# EAGLE schematic SSv3_1 (EAGLE 9.3.0)

## Sheet 1 of 6: PIC24FJ256GB106 POWER USB TRIGGER
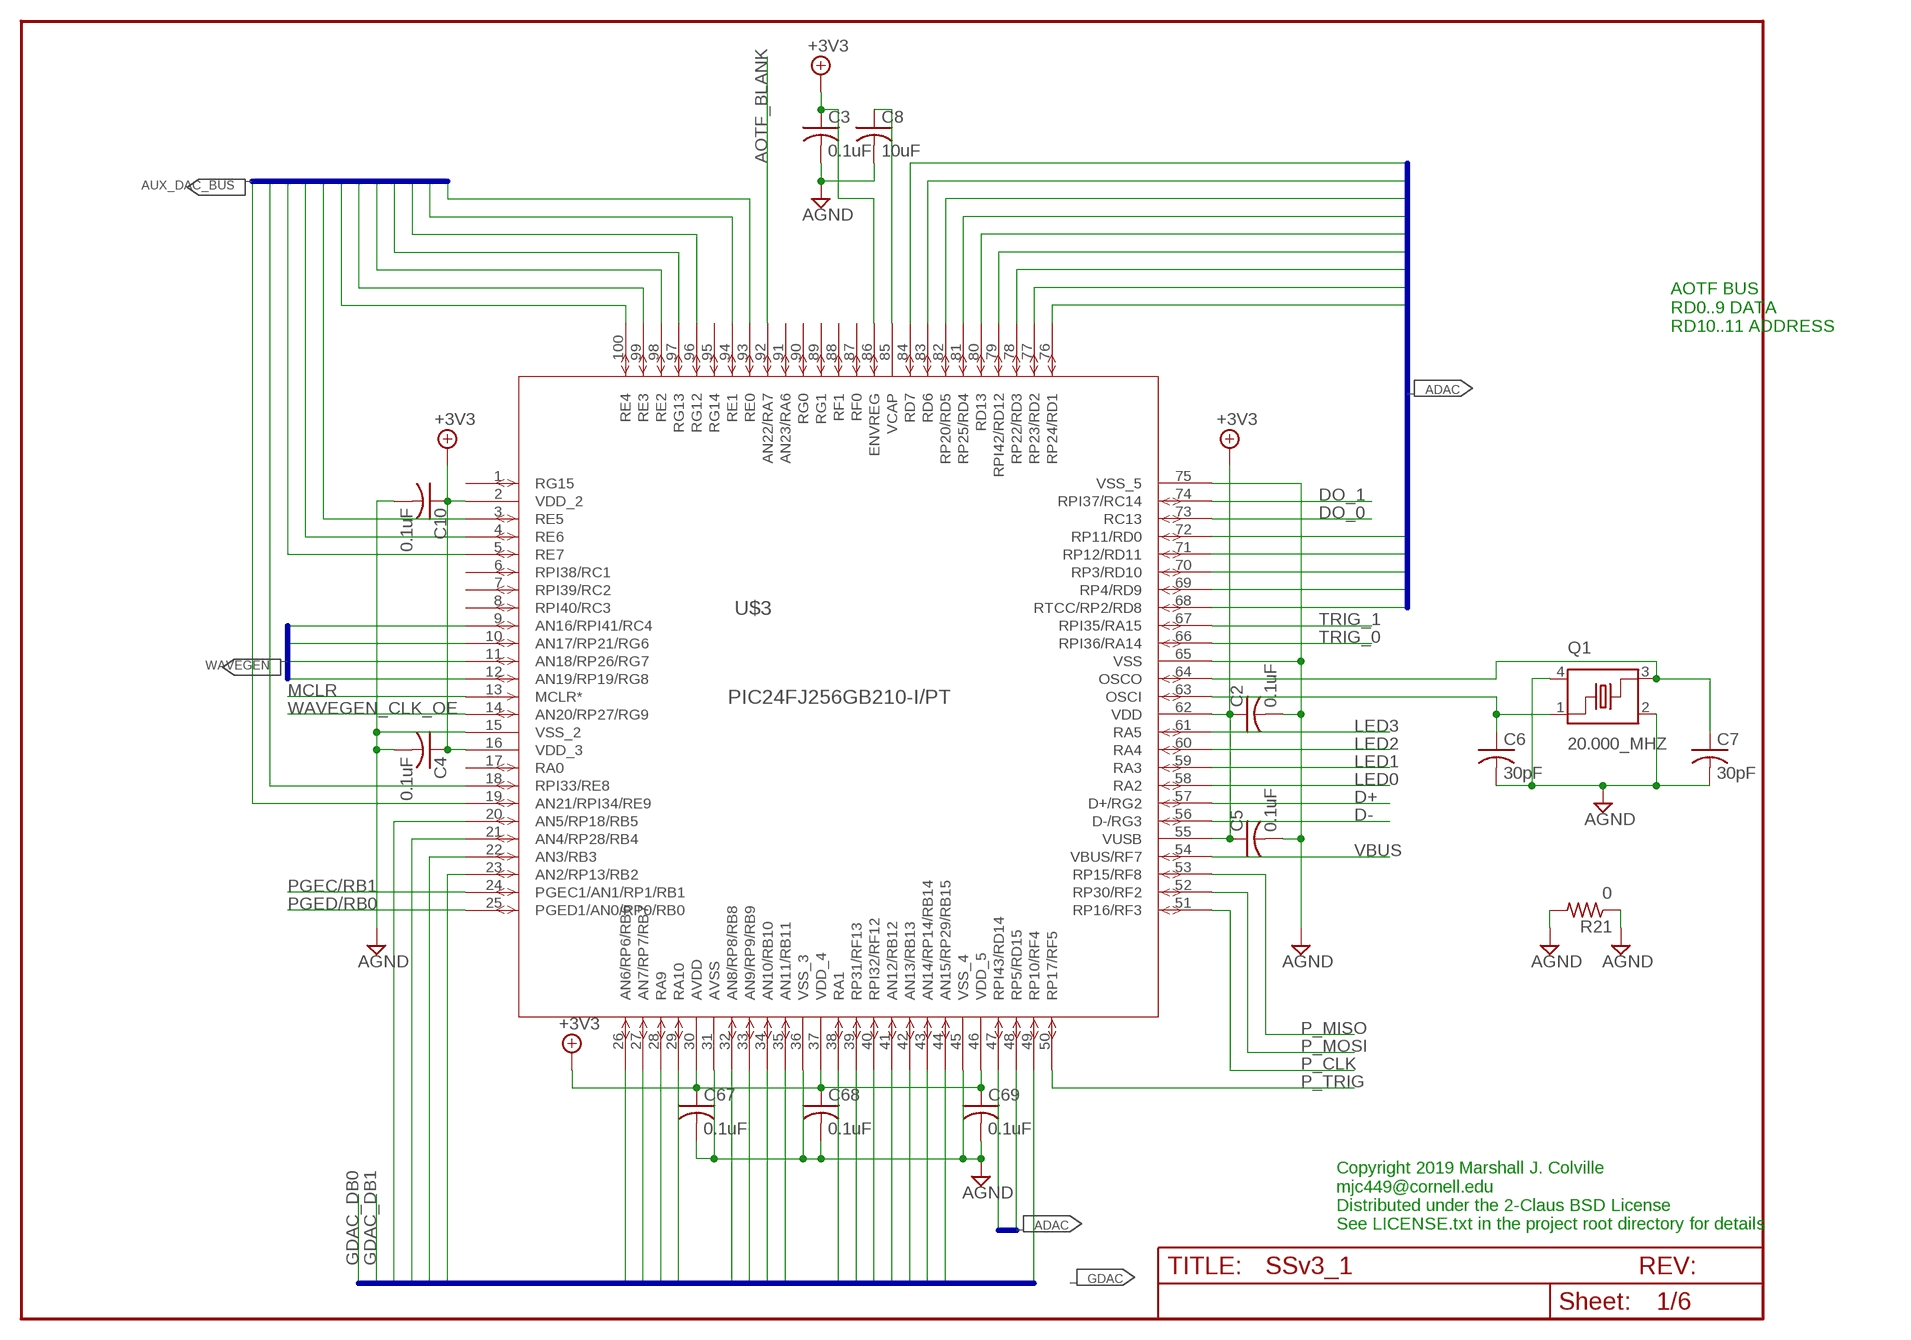
[diagram p0: schematic, sheet 1]

### Parts
C2  0.1uF  C-USC0603  [C0603]
C3  0.1uF  C-USC0603  [C0603]
C4  0.1uF  C-USC0603  [C0603]
C5  0.1uF  C-USC0603  [C0603]
C6  30pF  C-USC0603  [C0603]
C7  30pF  C-USC0603  [C0603]
C8  10uF  C-USC0805  [C0805]
C10  0.1uF  C-USC0603  [C0603]
C67  0.1uF  C-USC0603  [C0603]
C68  0.1uF  C-USC0603  [C0603]
C69  0.1uF  C-USC0603  [C0603]
Q1  20.000_MHZ  CRYSTALCTS406  [CTS406]
R21  0  R-US_R0603  [R0603]
U$3  PIC24FJ256GB210-I/PT  [TQFP100_12X12MC]

### Nets
+3V3: C2.1 C3.1 C4.1 C5.1 C10.1 C67.1 C68.1 C69.1 U$3.2(VDD_2) U$3.16(VDD_3) U$3.30(AVDD) U$3.37(VDD_4) U$3.46(VDD_5) U$3.55(VUSB) U$3.62(VDD) U$3.86(ENVREG) ; also sheet 2,3,4,5,6
ADAC0: U$3.72(RP11/RD0) ; also sheet 3
ADAC0_CS: U$3.79(RPI42/RD12) ; also sheet 3
ADAC1: U$3.76(RP24/RD1) ; also sheet 3
ADAC1_CS: U$3.80(RD13) ; also sheet 3
ADAC2: U$3.77(RP23/RD2) ; also sheet 3
ADAC3: U$3.78(RP22/RD3) ; also sheet 3
ADAC4: U$3.81(RP25/RD4) ; also sheet 3
ADAC5: U$3.82(RP20/RD5) ; also sheet 3
ADAC6: U$3.83(RD6) ; also sheet 3
ADAC7: U$3.84(RD7) ; also sheet 3
ADAC8: U$3.68(RTCC/RP2/RD8) ; also sheet 3
ADAC9: U$3.69(RP4/RD9) ; also sheet 3
ADAC_A0: U$3.70(RP3/RD10) ; also sheet 3
ADAC_A1: U$3.71(RP12/RD11) ; also sheet 3
ADAC_LOAD: U$3.47(RPI43/RD14) ; also sheet 3
ADAC_RS: U$3.48(RP5/RD15) ; also sheet 3
AGND: C2.2 C3.2 C4.2 C5.2 C6.2 C7.2 C8.2 C10.2 C67.2 C68.2 C69.2 Q1.2 Q1.4 R21.1 R21.2 U$3.15(VSS_2) U$3.31(AVSS) U$3.36(VSS_3) U$3.45(VSS_4) U$3.65(VSS) U$3.75(VSS_5) ; also sheet 2,3,4,5,6
AOTF_BLANK: U$3.92(AN22/RA7) ; also sheet 3
AUX_DAC_A/B: U$3.97(RG13) ; also sheet 4
AUX_DAC_CS: U$3.96(RG12) ; also sheet 4
AUX_DAC_DB0: U$3.93(RE0) ; also sheet 4
AUX_DAC_DB1: U$3.94(RE1) ; also sheet 4
AUX_DAC_DB2: U$3.98(RE2) ; also sheet 4
AUX_DAC_DB3: U$3.99(RE3) ; also sheet 4
AUX_DAC_DB4: U$3.100(RE4) ; also sheet 4
AUX_DAC_DB5: U$3.3(RE5) ; also sheet 4
AUX_DAC_DB6: U$3.4(RE6) ; also sheet 4
AUX_DAC_DB7: U$3.5(RE7) ; also sheet 4
AUX_DAC_DB8: U$3.18(RPI33/RE8) ; also sheet 4
AUX_DAC_DB9: U$3.19(AN21/RPI34/RE9) ; also sheet 4
D+: U$3.57(D+/RG2) ; also sheet 2
D-: U$3.56(D-/RG3) ; also sheet 2
DO_0: U$3.73(RC13) ; also sheet 2
DO_1: U$3.74(RPI37/RC14) ; also sheet 2
GDAC_A0: U$3.28(RA9) ; also sheet 6
GDAC_A1: U$3.29(RA10) ; also sheet 6
GDAC_DB2: U$3.23(AN2/RP13/RB2) ; also sheet 6
GDAC_DB3: U$3.22(AN3/RB3) ; also sheet 6
GDAC_DB4: U$3.21(AN4/RP28/RB4) ; also sheet 6
GDAC_DB5: U$3.20(AN5/RP18/RB5) ; also sheet 6
GDAC_DB6: U$3.26(AN6/RP6/RB6) ; also sheet 6
GDAC_DB7: U$3.27(AN7/RP7/RB7) ; also sheet 6
GDAC_DB8: U$3.32(AN8/RP8/RB8) ; also sheet 6
GDAC_DB9: U$3.33(AN9/RP9/RB9) ; also sheet 6
GDAC_DB10: U$3.34(AN10/RB10) ; also sheet 6
GDAC_DB11: U$3.35(AN11/RB11) ; also sheet 6
GDAC_DB12: U$3.41(AN12/RB12) ; also sheet 6
GDAC_DB13: U$3.42(AN13/RB13) ; also sheet 6
GDAC_DB14: U$3.43(AN14/RP14/RB14) ; also sheet 6
GDAC_DB15: U$3.44(AN15/RP29/RB15) ; also sheet 6
GDAC_LOAD: U$3.40(RPI32/RF12) ; also sheet 6
GDAC_RS: U$3.38(RA1) ; also sheet 6
LED0: U$3.58(RA2) ; also sheet 2
LED1: U$3.59(RA3) ; also sheet 2
LED2: U$3.60(RA4) ; also sheet 2
LED3: U$3.61(RA5) ; also sheet 2
MCLR: U$3.13(MCLR*) ; also sheet 2
N$1: C8.1 U$3.85(VCAP)
N$11: C6.1 Q1.1 U$3.63(OSCI)
N$34: C7.1 Q1.3 U$3.64(OSCO)
P_CLK: U$3.51(RP16/RF3) ; also sheet 2
P_MISO: U$3.53(RP15/RF8) ; also sheet 2
P_MOSI: U$3.52(RP30/RF2) ; also sheet 2
P_TRIG: U$3.50(RP17/RF5) ; also sheet 2
PGEC/RB1: U$3.24(PGEC1/AN1/RP1/RB1) ; also sheet 2
PGED/RB0: U$3.25(PGED1/AN0/RP0/RB0) ; also sheet 2
TRIG_0: U$3.66(RPI36/RA14) ; also sheet 2
TRIG_1: U$3.67(RPI35/RA15) ; also sheet 2
VBUS: U$3.54(VBUS/RF7) ; also sheet 2
WAVEGEN_CLK_OE: U$3.14(AN20/RP27/RG9) ; also sheet 5
WAVEGEN_SCK: U$3.10(AN17/RP21/RG6) ; also sheet 5
WAVEGEN_SYNC: U$3.11(AN18/RP26/RG7) ; also sheet 5
X_WAVEGEN_SDI: U$3.9(AN16/RPI41/RC4) ; also sheet 5
X_WR: U$3.39(RP31/RF13) ; also sheet 6
Y_WAVEGEN_SDI: U$3.12(AN19/RP19/RG8) ; also sheet 5
Y_WR: U$3.49(RP10/RF4) ; also sheet 6
Unconnected: U$3.1(RG15) U$3.6(RPI38/RC1) U$3.7(RPI39/RC2) U$3.8(RPI40/RC3) U$3.17(RA0) U$3.87(RF0) U$3.88(RF1) U$3.89(RG1) U$3.90(RG0) U$3.91(AN23/RA6) U$3.95(RG14)

### Buses
ADAC[0..9],ADAC_A0,ADAC_A1,ADAC0_CS,ADAC1_CS,ADAC_LOAD,ADAC_RS
AUX_DAC_DB[0..9],AUX_DAC_CS,AUX_DAC_A/B
WAVEGEN_SCK,WAVEGEN_SYNC,X_WAVEGEN_SDI,Y_WAVEGEN_SDI
GDAC_RS,X_WR,Y_WR,GDAC_LOAD,GDAC_A0,GDAC_A1,GDAC_DB[0..15]

### Notes on the sheet
- AOTF BUS
  RD0..9 DATA
  RD10..11 ADDRESS
- Copyright 2019 Marshall J. Colville
  mjc449@cornell.edu
  Distributed under the 2-Claus BSD License
  See LICENSE.txt in the project root directory for details

## Sheet 2 of 6: DIO, POWER, MISC
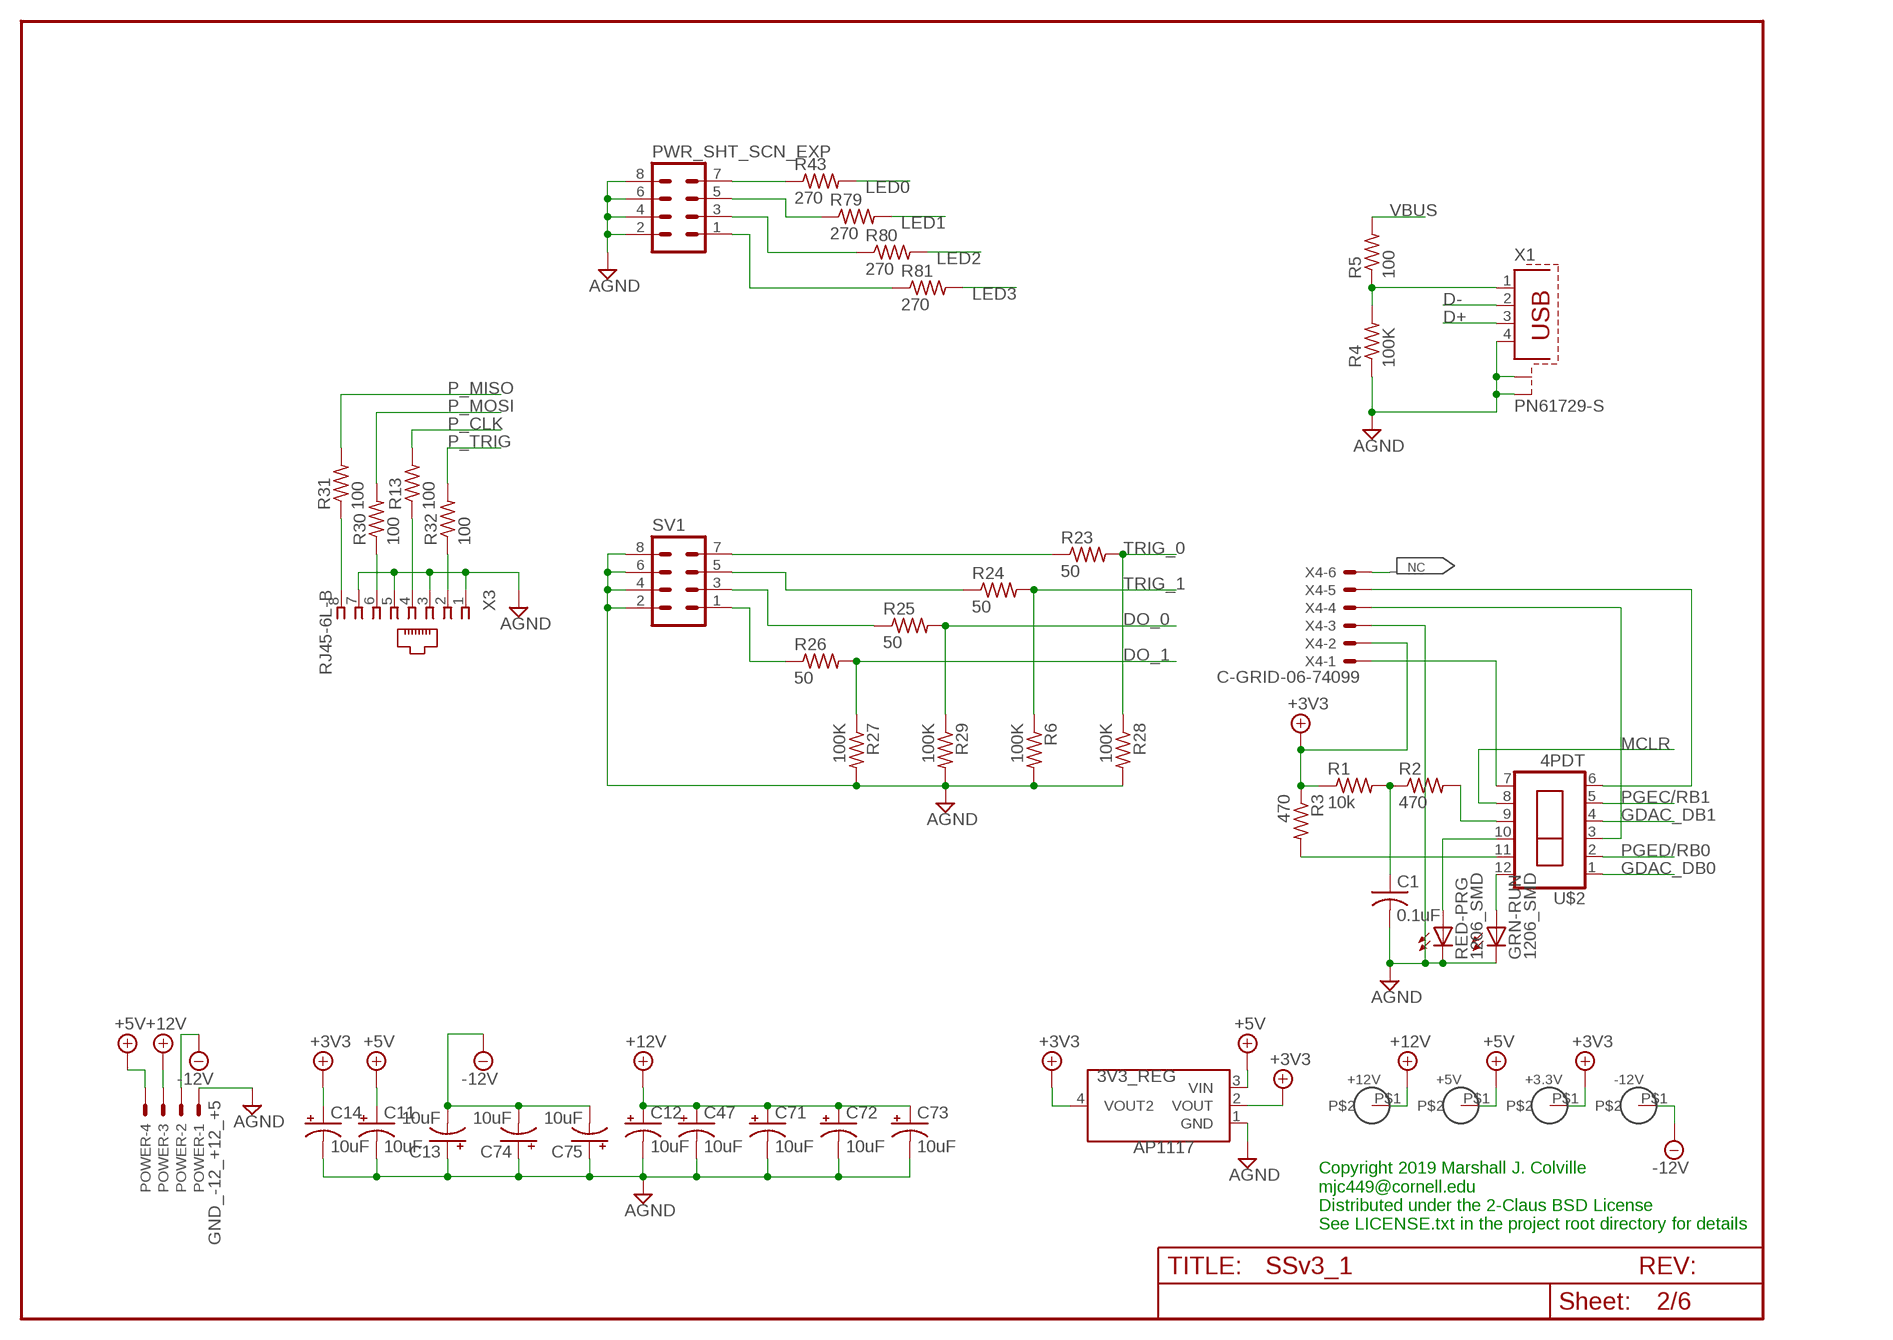
[diagram p1: schematic, sheet 2]

### Parts
3V3_REG  AP1117  AP1117E33G_REG  [SOT223]
+3.3V  TESTPOINT  [TESTPOINT]
+5V  TESTPOINT  [TESTPOINT]
+12V  TESTPOINT  [TESTPOINT]
-12V  TESTPOINT  [TESTPOINT]
C1  0.1uF  C-USC0603  [C0603]
C11  10uF  CPOL-USB  [PANASONIC_B]
C12  10uF  CPOL-USB  [PANASONIC_B]
C13  10uF  CPOL-USB  [PANASONIC_B]
C14  10uF  CPOL-USB  [PANASONIC_B]
C47  10uF  CPOL-USB  [PANASONIC_B]
C71  10uF  CPOL-USB  [PANASONIC_B]
C72  10uF  CPOL-USB  [PANASONIC_B]
C73  10uF  CPOL-USB  [PANASONIC_B]
C74  10uF  CPOL-USB  [PANASONIC_B]
C75  10uF  CPOL-USB  [PANASONIC_B]
GRN-RUN  1206_SMD  LED_1206_GREEN1206  [LED-1206]
POWER  GND_-12_+12_+5  4PINPIGTAIL  [22-23-2041]
PWR_SHT_SCN_EXP  MA04-2  [MA04-2]
R1  10k  R-US_R0603  [R0603]
R2  470  R-US_R0603  [R0603]
R3  470  R-US_R0603  [R0603]
R4  100K  R-US_R0603  [R0603]
R5  100  R-US_R0603  [R0603]
R6  100K  R-US_R0603  [R0603]
R13  100  R-US_R0603  [R0603]
R23  50  R-US_R0603  [R0603]
R24  50  R-US_R0603  [R0603]
R25  50  R-US_R0603  [R0603]
R26  50  R-US_R0603  [R0603]
R27  100K  R-US_R0603  [R0603]
R28  100K  R-US_R0603  [R0603]
R29  100K  R-US_R0603  [R0603]
R30  100  R-US_R0603  [R0603]
R31  100  R-US_R0603  [R0603]
R32  100  R-US_R0603  [R0603]
R43  270  R-US_R0603  [R0603]
R79  270  R-US_R0603  [R0603]
R80  270  R-US_R0603  [R0603]
R81  270  R-US_R0603  [R0603]
RED-PRG  1206_SMD  LED_1206_RED1206  [LED-1206]
SV1  MA04-2  [MA04-2]
U$2  4PDT  4PDTSMD_GULL_WING  [4PDT_SMD]
X1  PN61729-S  [PN61729-S]
X3  RJ45-6L-B  [RJ45-NO-SHIELD]
X4  C-GRID-06-74099  [74099-06]

### Nets
+3V3: 3V3_REG.2(VOUT) 3V3_REG.4(VOUT2) +3.3V.P$1 C14.+ R1.1 R3.1 X4.2 ; also sheet 1,3,4,5,6
+5V: 3V3_REG.3(VIN) +5V.P$1 C11.+ POWER.4 ; also sheet 3
+12V: +12V.P$1 C12.+ C47.+ C71.+ C72.+ C73.+ POWER.3 ; also sheet 3,4,5,6
-12V: -12V.P$1 C13.- C74.- C75.- POWER.2 ; also sheet 4,5,6
AGND: 3V3_REG.1(GND) C1.2 C11.- C12.- C13.+ C14.- C47.- C71.- C72.- C73.- C74.+ C75.+ GRN-RUN.C POWER.1 PWR_SHT_SCN_EXP.2 PWR_SHT_SCN_EXP.4 PWR_SHT_SCN_EXP.6 PWR_SHT_SCN_EXP.8 R4.1 R6.2 R27.2 R28.2 R29.2 RED-PRG.C SV1.2 SV1.4 SV1.6 SV1.8 X1.4 X1.S1 X1.S2 X3.1 X3.3 X3.5 X3.7 X4.3 ; also sheet 1,3,4,5,6
D+: X1.3 ; also sheet 1
D-: X1.2 ; also sheet 1
DO_0: R25.2 R29.1 ; also sheet 1
DO_1: R26.2 R27.1 ; also sheet 1
GDAC_DB0: U$2.1 ; also sheet 1,6
GDAC_DB1: U$2.4 ; also sheet 1,6
LED0: R43.2 ; also sheet 1
LED1: R79.2 ; also sheet 1
LED2: R80.2 ; also sheet 1
LED3: R81.2 ; also sheet 1
MCLR: U$2.8 ; also sheet 1
N$2: U$2.7 X4.1
N$3: PWR_SHT_SCN_EXP.7 R43.1
N$4: R2.2 U$2.9
N$5: C1.1 R1.2 R2.1
N$6: R3.2 U$2.11
N$7: RED-PRG.A U$2.10
N$8: GRN-RUN.A U$2.12
N$12: R31.1 X3.8
N$32: R30.1 X3.6
N$39: PWR_SHT_SCN_EXP.5 R79.1
N$44: PWR_SHT_SCN_EXP.3 R80.1
N$45: PWR_SHT_SCN_EXP.1 R81.1
N$47: R13.1 X3.4
N$48: R32.1 X3.2
N$50: X4.6
N$64: R25.1 SV1.3
N$87: R24.1 SV1.5
N$88: R23.1 SV1.7
N$89: R26.1 SV1.1
P_CLK: R13.2 ; also sheet 1
P_MISO: R31.2 ; also sheet 1
P_MOSI: R30.2 ; also sheet 1
P_TRIG: R32.2 ; also sheet 1
PGEC: U$2.6 X4.5
PGEC/RB1: U$2.5 ; also sheet 1
PGED: U$2.3 X4.4
PGED/RB0: U$2.2 ; also sheet 1
TRIG_0: R23.2 R28.1 ; also sheet 1
TRIG_1: R6.1 R24.2 ; also sheet 1
USB1: R4.2 R5.1 X1.1
VBUS: R5.2 ; also sheet 1

### Notes on the sheet
- Copyright 2019 Marshall J. Colville
  mjc449@cornell.edu
  Distributed under the 2-Claus BSD License
  See LICENSE.txt in the project root directory for details

## Sheet 3 of 6: AOTF DAC
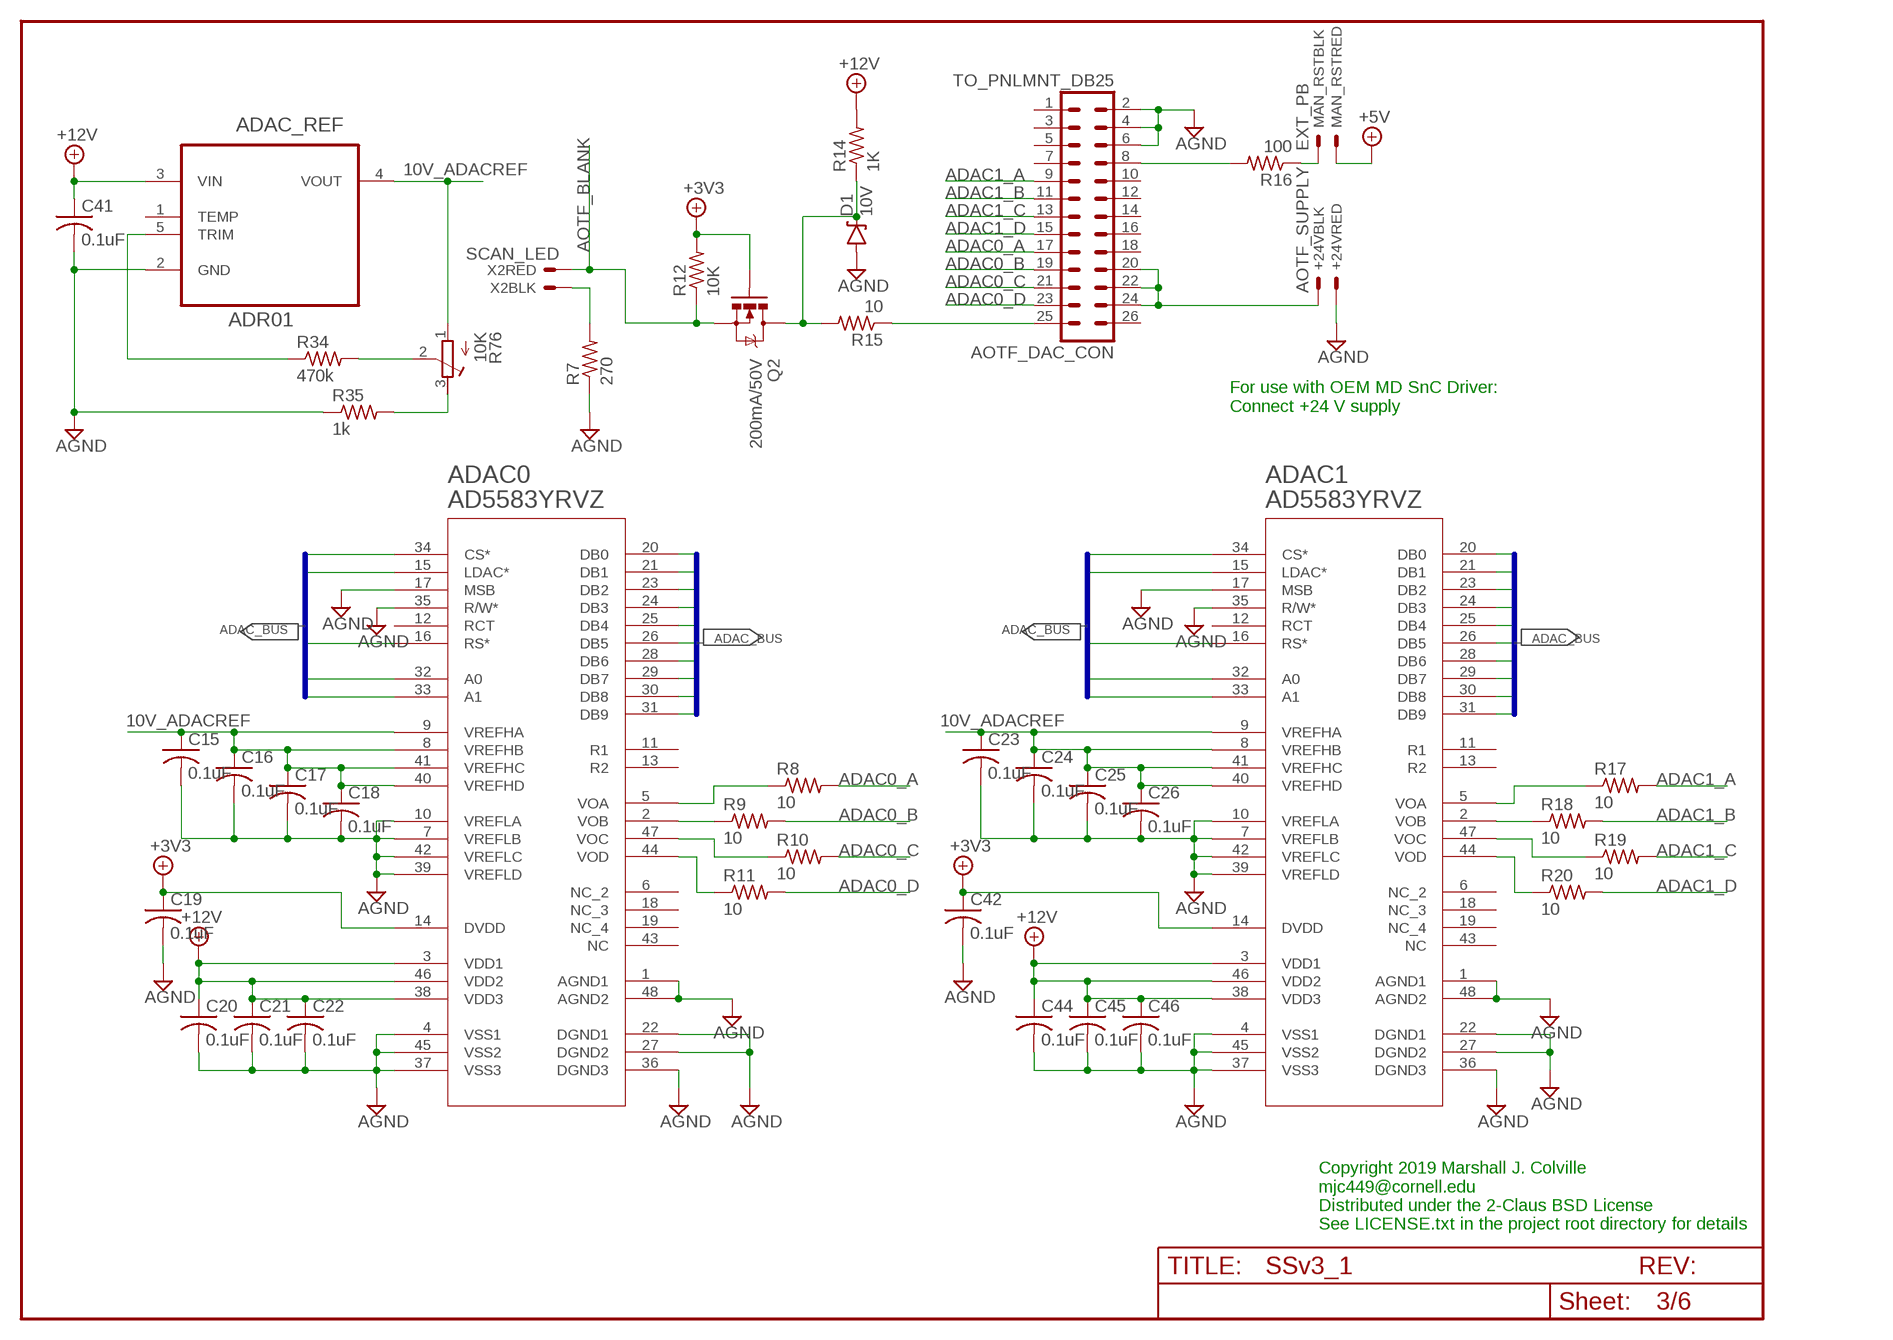
[diagram p2: schematic, sheet 3]

### Parts
+24V  AOTF_SUPPLY  2PINHEADER  [22-23-2021]
ADAC0  AD5583YRVZ  [RV_48]
ADAC1  AD5583YRVZ  [RV_48]
ADAC_REF  ADR01  ADR03AKSZ-REEL7  [SOT65P210X110-5N]
AOTF_DAC_CON  TO_PNLMNT_DB25  ML26  [ML26]
C15  0.1uF  C-USC0603  [C0603]
C16  0.1uF  C-USC0603  [C0603]
C17  0.1uF  C-USC0603  [C0603]
C18  0.1uF  C-USC0603  [C0603]
C19  0.1uF  C-USC0603  [C0603]
C20  0.1uF  C-USC0603  [C0603]
C21  0.1uF  C-USC0603  [C0603]
C22  0.1uF  C-USC0603  [C0603]
C23  0.1uF  C-USC0603  [C0603]
C24  0.1uF  C-USC0603  [C0603]
C25  0.1uF  C-USC0603  [C0603]
C26  0.1uF  C-USC0603  [C0603]
C41  0.1uF  C-USC0603  [C0603]
C42  0.1uF  C-USC0603  [C0603]
C44  0.1uF  C-USC0603  [C0603]
C45  0.1uF  C-USC0603  [C0603]
C46  0.1uF  C-USC0603  [C0603]
D1  10V  DIODE-ZENER16V  [SOD-123]
MAN_RST  EXT_PB  2PINHEADER  [22-23-2021]
Q2  200mA/50V  MOSFET-NCHANNELBSS138  [SOT23-3]
R7  270  R-US_R0603  [R0603]
R8  10  R-US_R0603  [R0603]
R9  10  R-US_R0603  [R0603]
R10  10  R-US_R0603  [R0603]
R11  10  R-US_R0603  [R0603]
R12  10K  R-US_R0603  [R0603]
R14  1K  R-US_R0603  [R0603]
R15  10  R-US_R0603  [R0603]
R16  100  R-US_R0603  [R0603]
R17  10  R-US_R0603  [R0603]
R18  10  R-US_R0603  [R0603]
R19  10  R-US_R0603  [R0603]
R20  10  R-US_R0603  [R0603]
R34  470k  R-US_R0603  [R0603]
R35  1k  R-US_R0603  [R0603]
R76  10K  R-TRIMMTS63Y  [RTRIMTS63Y]
X2  SCAN_LED  2PINHEADER  [22-23-2021]

### Nets
10V_ADACREF: ADAC0.8(VREFHB) ADAC0.9(VREFHA) ADAC0.40(VREFHD) ADAC0.41(VREFHC) ADAC1.8(VREFHB) ADAC1.9(VREFHA) ADAC1.40(VREFHD) ADAC1.41(VREFHC) ADAC_REF.4(VOUT) C15.1 C16.1 C17.1 C18.1 C23.1 C24.1 C25.1 C26.1 R76.1(A)
+3V3: ADAC0.14(DVDD) ADAC1.14(DVDD) C19.1 C42.1 Q2.1(G) R12.2 ; also sheet 1,2,4,5,6
+5V: MAN_RST.2 ; also sheet 2
+12V: ADAC0.3(VDD1) ADAC0.38(VDD3) ADAC0.46(VDD2) ADAC1.3(VDD1) ADAC1.38(VDD3) ADAC1.46(VDD2) ADAC_REF.3(VIN) C20.1 C21.1 C22.1 C41.1 C44.1 C45.1 C46.1 R14.2 ; also sheet 2,4,5,6
+24V: +24V.1 AOTF_DAC_CON.20 AOTF_DAC_CON.22 AOTF_DAC_CON.24
ADAC0: ADAC0.20(DB0) ADAC1.20(DB0) ; also sheet 1
ADAC0_A: AOTF_DAC_CON.17 R8.2
ADAC0_B: AOTF_DAC_CON.19 R9.2
ADAC0_C: AOTF_DAC_CON.21 R10.2
ADAC0_CS: ADAC0.34(CS*) ; also sheet 1
ADAC0_D: AOTF_DAC_CON.23 R11.2
ADAC1: ADAC0.21(DB1) ADAC1.21(DB1) ; also sheet 1
ADAC1_A: AOTF_DAC_CON.9 R17.2
ADAC1_B: AOTF_DAC_CON.11 R18.2
ADAC1_C: AOTF_DAC_CON.13 R19.2
ADAC1_CS: ADAC1.34(CS*) ; also sheet 1
ADAC1_D: AOTF_DAC_CON.15 R20.2
ADAC2: ADAC0.23(DB2) ADAC1.23(DB2) ; also sheet 1
ADAC3: ADAC0.24(DB3) ADAC1.24(DB3) ; also sheet 1
ADAC4: ADAC0.25(DB4) ADAC1.25(DB4) ; also sheet 1
ADAC5: ADAC0.26(DB5) ADAC1.26(DB5) ; also sheet 1
ADAC6: ADAC0.28(DB6) ADAC1.28(DB6) ; also sheet 1
ADAC7: ADAC0.29(DB7) ADAC1.29(DB7) ; also sheet 1
ADAC8: ADAC0.30(DB8) ADAC1.30(DB8) ; also sheet 1
ADAC9: ADAC0.31(DB9) ADAC1.31(DB9) ; also sheet 1
ADAC_A0: ADAC0.32(A0) ADAC1.32(A0) ; also sheet 1
ADAC_A1: ADAC0.33(A1) ADAC1.33(A1) ; also sheet 1
ADAC_LOAD: ADAC0.15(LDAC*) ADAC1.15(LDAC*) ; also sheet 1
ADAC_RS: ADAC0.16(RS*) ADAC1.16(RS*) ; also sheet 1
AGND: +24V.2 ADAC0.1(AGND1) ADAC0.4(VSS1) ADAC0.7(VREFLB) ADAC0.10(VREFLA) ADAC0.17(MSB) ADAC0.22(DGND1) ADAC0.27(DGND2) ADAC0.35(R/W*) ADAC0.36(DGND3) ADAC0.37(VSS3) ADAC0.39(VREFLD) ADAC0.42(VREFLC) ADAC0.45(VSS2) ADAC0.48(AGND2) ADAC1.1(AGND1) ADAC1.4(VSS1) ADAC1.7(VREFLB) ADAC1.10(VREFLA) ADAC1.17(MSB) ADAC1.22(DGND1) ADAC1.27(DGND2) ADAC1.35(R/W*) ADAC1.36(DGND3) ADAC1.37(VSS3) ADAC1.39(VREFLD) ADAC1.42(VREFLC) ADAC1.45(VSS2) ADAC1.48(AGND2) ADAC_REF.2(GND) AOTF_DAC_CON.2 AOTF_DAC_CON.4 AOTF_DAC_CON.6 C15.2 C16.2 C17.2 C18.2 C19.2 C20.2 C21.2 C22.2 C23.2 C24.2 C25.2 C26.2 C41.2 C42.2 C44.2 C45.2 C46.2 D1.A R7.1 R35.1 ; also sheet 1,2,4,5,6
AOTF_BLANK: Q2.2(S) R12.1 X2.2 ; also sheet 1
N$10: R34.2 R76.2(S)
N$13: D1.C Q2.3(D) R14.1 R15.2
N$14: AOTF_DAC_CON.8 R16.2
N$15: ADAC0.44(VOD) R11.1
N$16: ADAC0.47(VOC) R10.1
N$17: ADAC0.2(VOB) R9.1
N$18: ADAC0.5(VOA) R8.1
N$19: ADAC1.5(VOA) R17.1
N$20: ADAC1.2(VOB) R18.1
N$21: ADAC1.47(VOC) R19.1
N$22: ADAC1.44(VOD) R20.1
N$43: ADAC_REF.5(TRIM) R34.1
N$55: R35.2 R76.3(E)
N$61: AOTF_DAC_CON.25 R15.1
N$63: MAN_RST.1 R16.1
SCAN_LED-: R7.2 X2.1
Unconnected: ADAC0.6(NC_2) ADAC0.11(R1) ADAC0.12(RCT) ADAC0.13(R2) ADAC0.18(NC_3) ADAC0.19(NC_4) ADAC0.43(NC) ADAC1.6(NC_2) ADAC1.11(R1) ADAC1.12(RCT) ADAC1.13(R2) ADAC1.18(NC_3) ADAC1.19(NC_4) ADAC1.43(NC) ADAC_REF.1(TEMP) AOTF_DAC_CON.1 AOTF_DAC_CON.3 AOTF_DAC_CON.5 AOTF_DAC_CON.7 AOTF_DAC_CON.10 AOTF_DAC_CON.12 AOTF_DAC_CON.14 AOTF_DAC_CON.16 AOTF_DAC_CON.18 AOTF_DAC_CON.26

### Buses
ADAC[0..9]
ADAC[0..9],ADAC_A0,ADAC_A1,ADAC0_CS,ADAC1_CS,ADAC_LOAD,ADAC_RS

### Notes on the sheet
- For use with OEM MD SnC Driver:
  Connect +24 V supply
- Copyright 2019 Marshall J. Colville
  mjc449@cornell.edu
  Distributed under the 2-Claus BSD License
  See LICENSE.txt in the project root directory for details

## Sheet 4 of 6: AUX_DAC
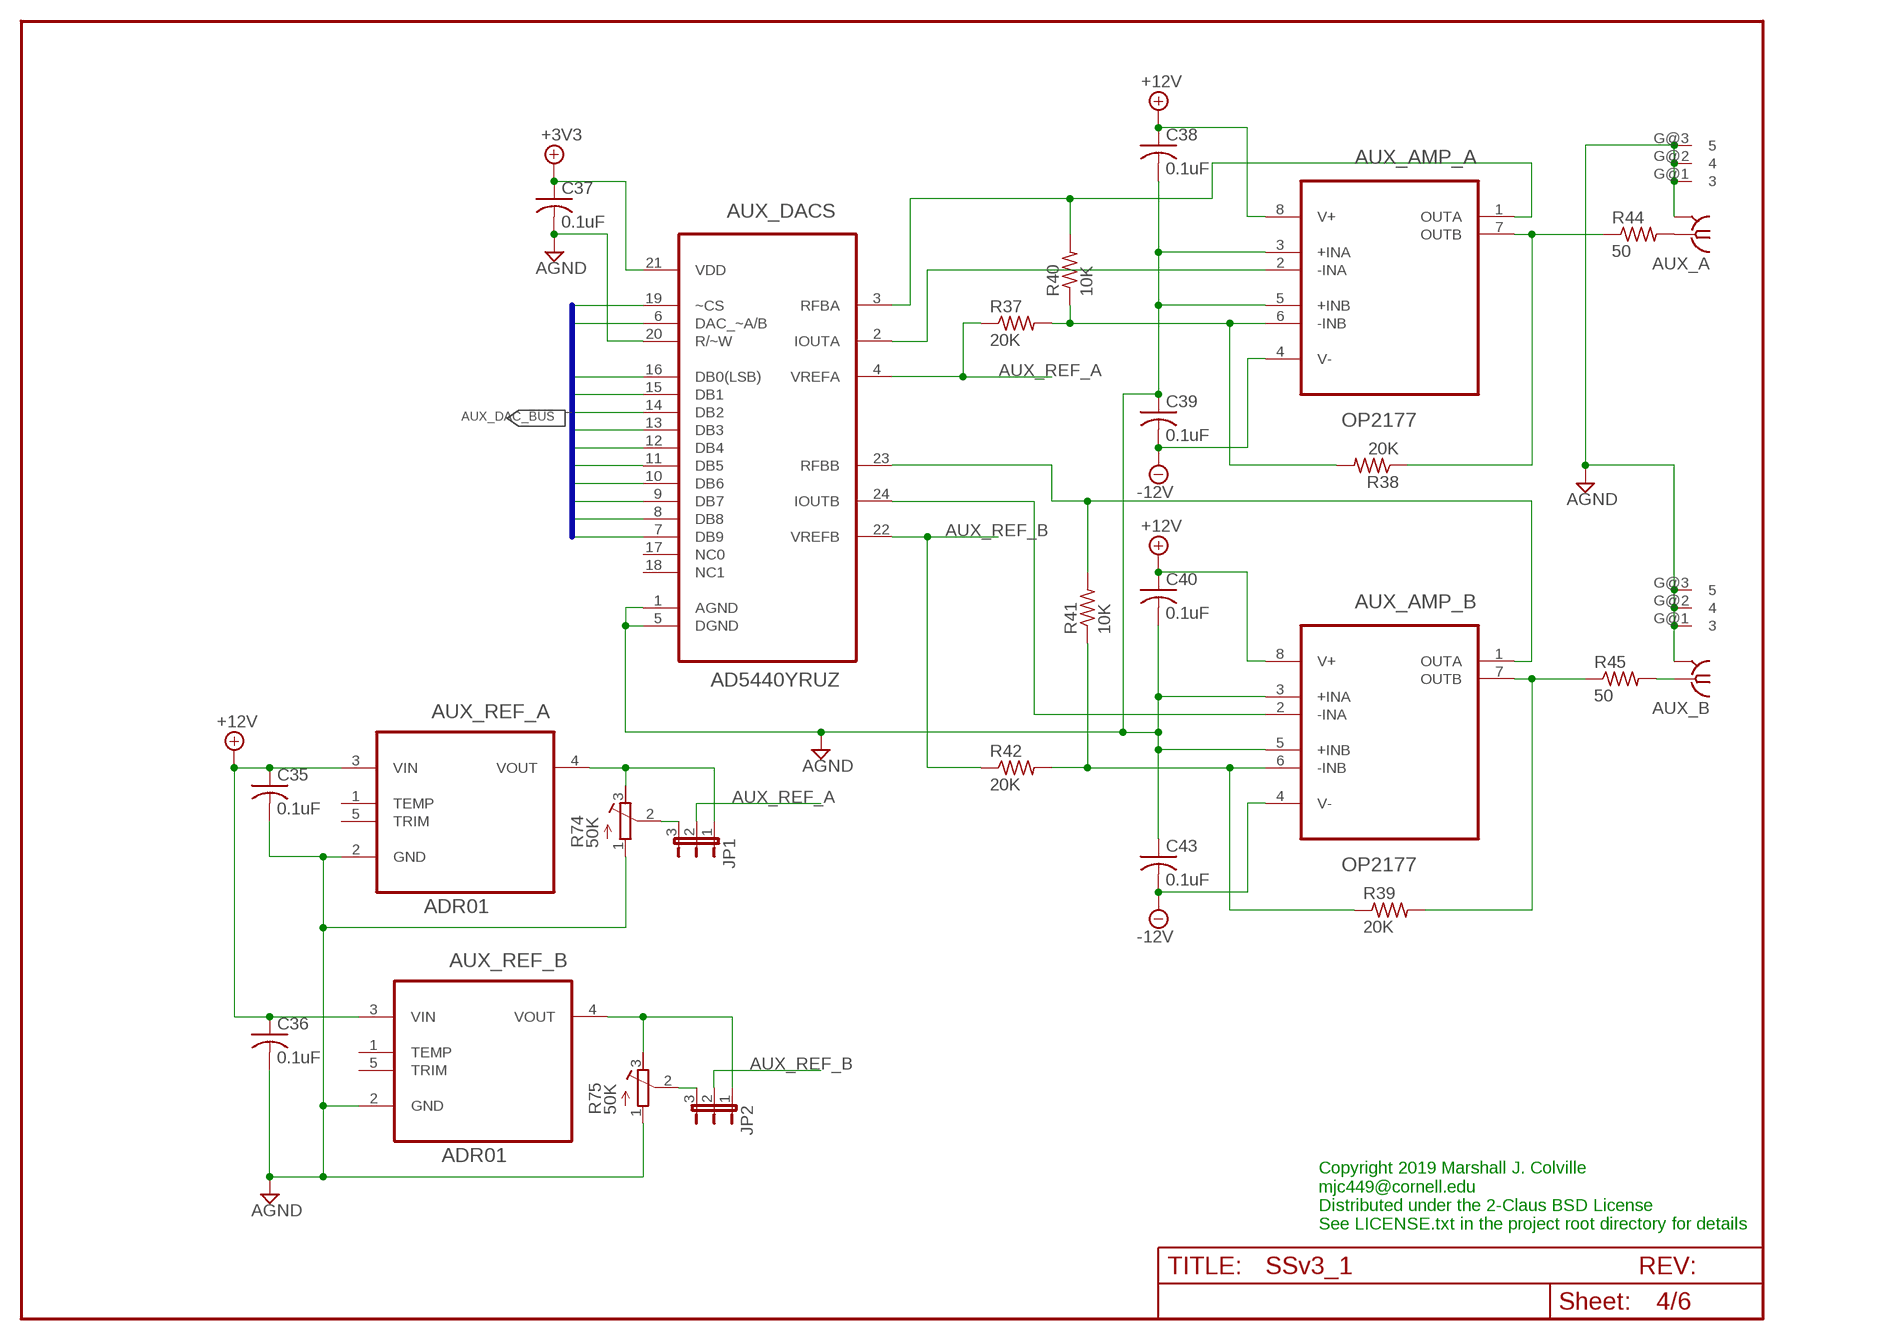
[diagram p3: schematic, sheet 4]

### Parts
AUX_A  SMA_SMT  [SIDE_MOUNTSMA]
AUX_AMP_A  OP2177  OP2177ARMZ-R7  [SOP65P490X110-8N]
AUX_AMP_B  OP2177  OP2177ARMZ-R7  [SOP65P490X110-8N]
AUX_B  SMA_SMT  [SIDE_MOUNTSMA]
AUX_DACS  AD5440YRUZ  AD5440YRUZTSSOP-24  [SOP65P640X120-24N]
AUX_REF_A  ADR01  ADR03AKSZ-REEL7  [SOT65P210X110-5N]
AUX_REF_B  ADR01  ADR03AKSZ-REEL7  [SOT65P210X110-5N]
C35  0.1uF  C-USC0603  [C0603]
C36  0.1uF  C-USC0603  [C0603]
C37  0.1uF  C-USC0603  [C0603]
C38  0.1uF  C-USC0603  [C0603]
C39  0.1uF  C-USC0603  [C0603]
C40  0.1uF  C-USC0603  [C0603]
C43  0.1uF  C-USC0603  [C0603]
JP1  JP2E  [JP2]
JP2  JP2E  [JP2]
R37  20K  R-US_R0603  [R0603]
R38  20K  R-US_R0603  [R0603]
R39  20K  R-US_R0603  [R0603]
R40  10K  R-US_R0603  [R0603]
R41  10K  R-US_R0603  [R0603]
R42  20K  R-US_R0603  [R0603]
R44  50  R-US_R0603  [R0603]
R45  50  R-US_R0603  [R0603]
R74  50K  R-TRIMMTS63Y  [RTRIMTS63Y]
R75  50K  R-TRIMMTS63Y  [RTRIMTS63Y]

### Nets
+3V3: AUX_DACS.21(VDD) C37.1 ; also sheet 1,2,3,5,6
+12V: AUX_AMP_A.8(V+) AUX_AMP_B.8(V+) AUX_REF_A.3(VIN) AUX_REF_B.3(VIN) C35.1 C36.1 C38.1 C40.1 ; also sheet 2,3,5,6
-12V: AUX_AMP_A.4(V-) AUX_AMP_B.4(V-) C39.2 C43.2 ; also sheet 2,5,6
AGND: AUX_A.G@1 AUX_A.G@2 AUX_A.G@3 AUX_A.G@4 AUX_AMP_A.3(+INA) AUX_AMP_A.5(+INB) AUX_AMP_B.3(+INA) AUX_AMP_B.5(+INB) AUX_B.G@1 AUX_B.G@2 AUX_B.G@3 AUX_B.G@4 AUX_DACS.1(AGND) AUX_DACS.5(DGND) AUX_DACS.20(R/~W) AUX_REF_A.2(GND) AUX_REF_B.2(GND) C35.2 C36.2 C37.2 C38.2 C39.1 C40.2 C43.1 R74.1(A) R75.1(A) ; also sheet 1,2,3,5,6
AUX_DAC_A/B: AUX_DACS.6(DAC_~A/B) ; also sheet 1
AUX_DAC_CS: AUX_DACS.19(~CS) ; also sheet 1
AUX_DAC_DB0: AUX_DACS.16(DB0(LSB)) ; also sheet 1
AUX_DAC_DB1: AUX_DACS.15(DB1) ; also sheet 1
AUX_DAC_DB2: AUX_DACS.14(DB2) ; also sheet 1
AUX_DAC_DB3: AUX_DACS.13(DB3) ; also sheet 1
AUX_DAC_DB4: AUX_DACS.12(DB4) ; also sheet 1
AUX_DAC_DB5: AUX_DACS.11(DB5) ; also sheet 1
AUX_DAC_DB6: AUX_DACS.10(DB6) ; also sheet 1
AUX_DAC_DB7: AUX_DACS.9(DB7) ; also sheet 1
AUX_DAC_DB8: AUX_DACS.8(DB8) ; also sheet 1
AUX_DAC_DB9: AUX_DACS.7(DB9) ; also sheet 1
AUX_REF_A: AUX_DACS.4(VREFA) JP1.2 R37.1
AUX_REF_B: AUX_DACS.22(VREFB) JP2.2 R42.1
N$46: AUX_REF_B.4(VOUT) JP2.1 R75.3(E)
N$51: AUX_AMP_A.2(-INA) AUX_DACS.2(IOUTA)
N$52: AUX_AMP_A.1(OUTA) AUX_DACS.3(RFBA) R40.2
N$53: JP1.3 R74.2(S)
N$66: AUX_REF_A.4(VOUT) JP1.1 R74.3(E)
N$67: AUX_AMP_A.6(-INB) R37.2 R38.2 R40.1
N$68: AUX_AMP_B.2(-INA) AUX_DACS.24(IOUTB)
N$70: AUX_AMP_A.7(OUTB) R38.1 R44.1
N$71: AUX_AMP_B.1(OUTA) AUX_DACS.23(RFBB) R41.2
N$72: AUX_A.1 R44.2
N$73: AUX_AMP_B.6(-INB) R39.1 R41.1 R42.2
N$74: AUX_B.1 R45.2
N$76: AUX_AMP_B.7(OUTB) R39.2 R45.1
N$86: JP2.3 R75.2(S)
Unconnected: AUX_DACS.17(NC0) AUX_DACS.18(NC1) AUX_REF_A.1(TEMP) AUX_REF_A.5(TRIM) AUX_REF_B.1(TEMP) AUX_REF_B.5(TRIM)

### Buses
AUX_DAC_DB[0..9],AUX_DAC_CS,AUX_DAC_A/B

### Notes on the sheet
- Copyright 2019 Marshall J. Colville
  mjc449@cornell.edu
  Distributed under the 2-Claus BSD License
  See LICENSE.txt in the project root directory for details

## Sheet 5 of 6: GALVO_SIGNAL_GENERATION
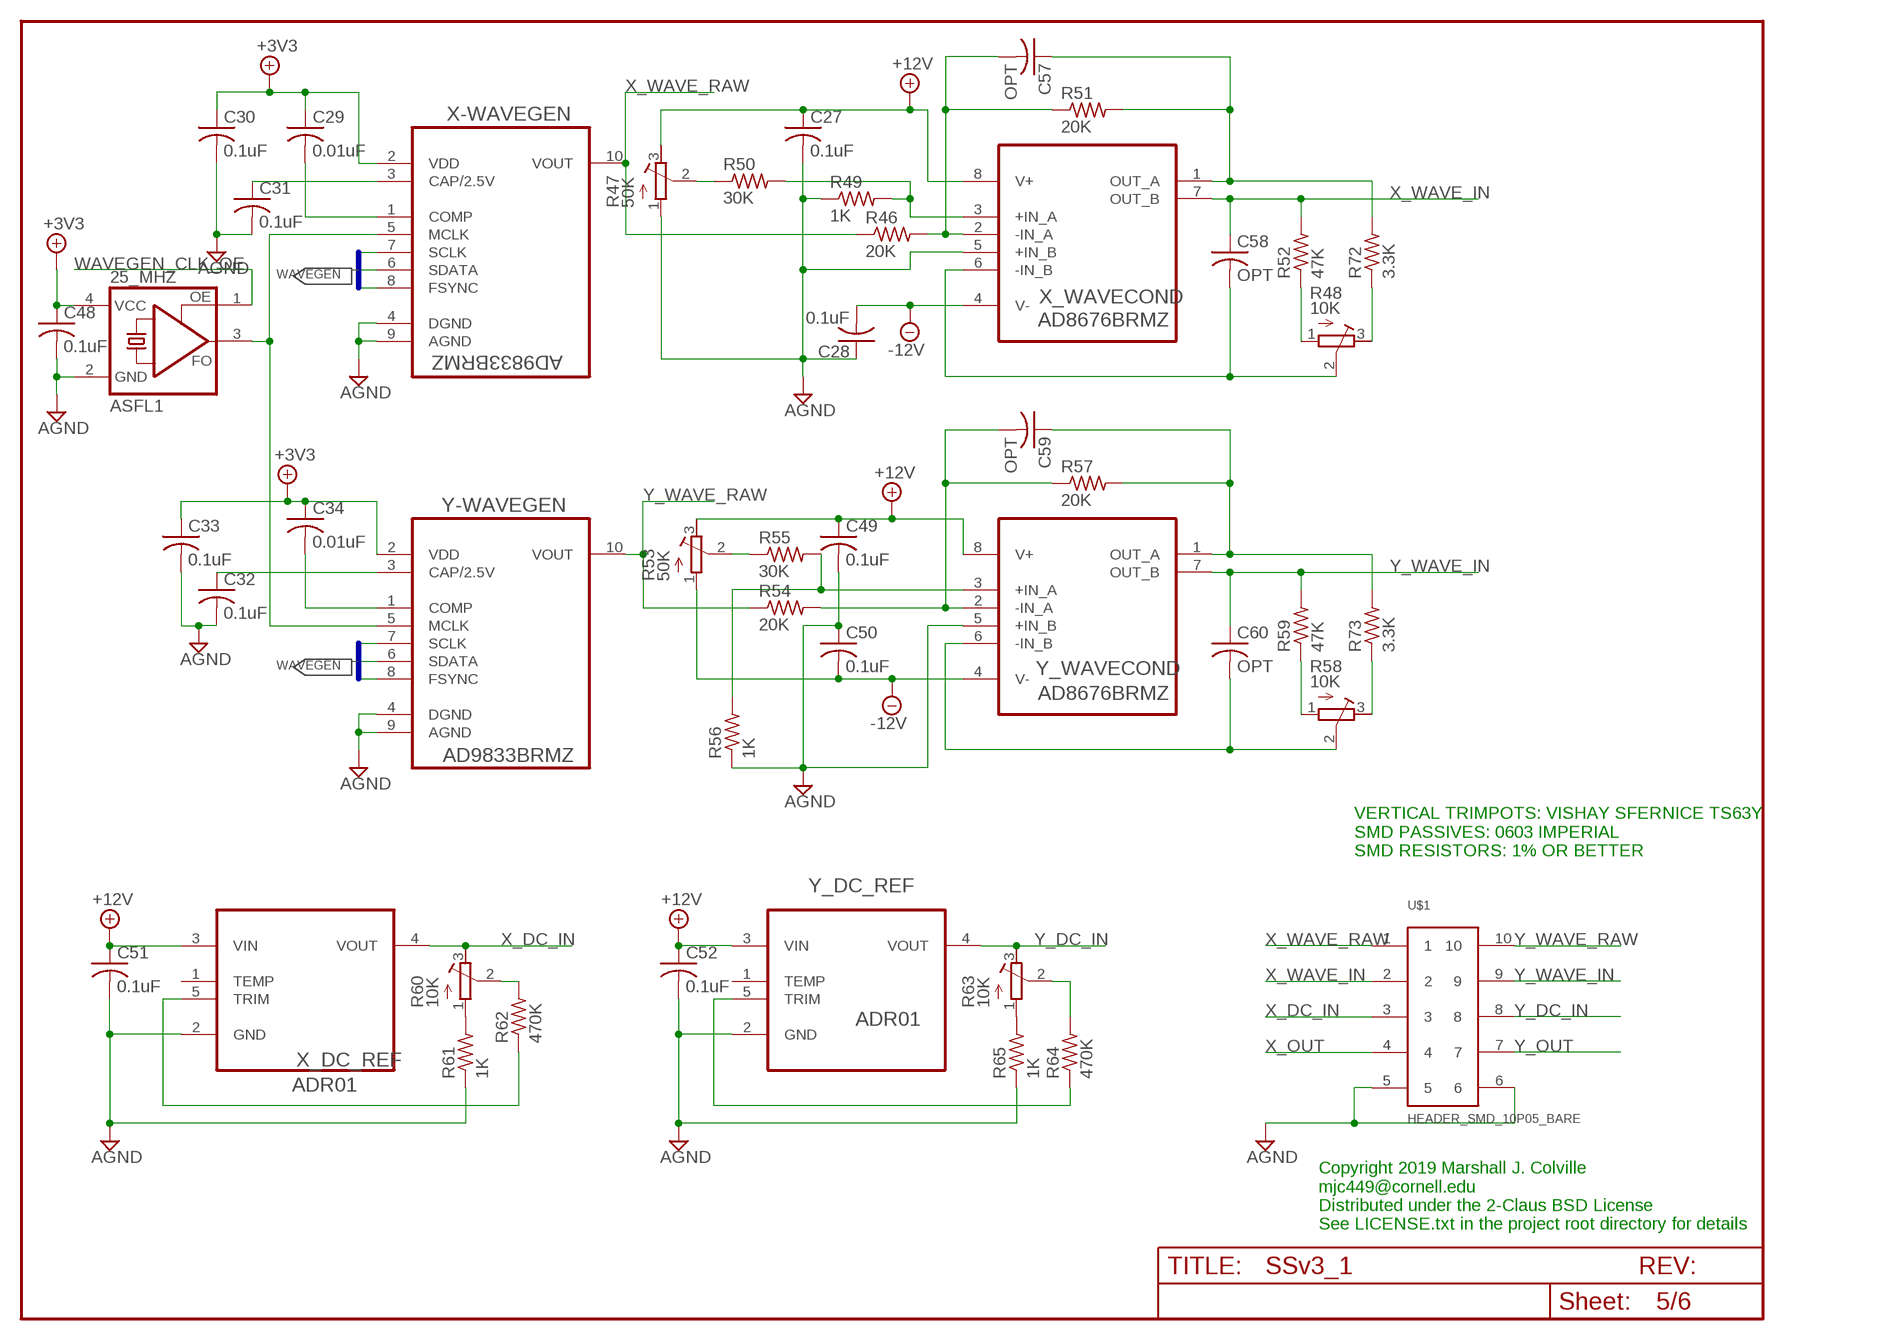
[diagram p4: schematic, sheet 5]

### Parts
25_MHZ  ASFL1  [ASF]
C27  0.1uF  C-USC0603  [C0603]
C28  0.1uF  C-USC0603  [C0603]
C29  0.01uF  C-USC0603  [C0603]
C30  0.1uF  C-USC0603  [C0603]
C31  0.1uF  C-USC0603  [C0603]
C32  0.1uF  C-USC0603  [C0603]
C33  0.1uF  C-USC0603  [C0603]
C34  0.01uF  C-USC0603  [C0603]
C48  0.1uF  C-USC0603  [C0603]
C49  0.1uF  C-USC0603  [C0603]
C50  0.1uF  C-USC0603  [C0603]
C51  0.1uF  C-USC0603  [C0603]
C52  0.1uF  C-USC0603  [C0603]
C57  OPT  C-USC0603  [C0603]
C58  OPT  C-USC0603  [C0603]
C59  OPT  C-USC0603  [C0603]
C60  OPT  C-USC0603  [C0603]
R46  20K  R-US_R0603  [R0603]
R47  50K  R-TRIMMTS63Y  [RTRIMTS63Y]
R48  10K  R-TRIMMTS63Y  [RTRIMTS63Y]
R49  1K  R-US_R0603  [R0603]
R50  30K  R-US_R0603  [R0603]
R51  20K  R-US_R0603  [R0603]
R52  47K  R-US_R0603  [R0603]
R53  50K  R-TRIMMTS63Y  [RTRIMTS63Y]
R54  20K  R-US_R0603  [R0603]
R55  30K  R-US_R0603  [R0603]
R56  1K  R-US_R0603  [R0603]
R57  20K  R-US_R0603  [R0603]
R58  10K  R-TRIMMTS63Y  [RTRIMTS63Y]
R59  47K  R-US_R0603  [R0603]
R60  10K  R-TRIMMTS63Y  [RTRIMTS63Y]
R61  1K  R-US_R0603  [R0603]
R62  470K  R-US_R0603  [R0603]
R63  10K  R-TRIMMTS63Y  [RTRIMTS63Y]
R64  470K  R-US_R0603  [R0603]
R65  1K  R-US_R0603  [R0603]
R72  3.3K  R-US_R0603  [R0603]
R73  3.3K  R-US_R0603  [R0603]
U$1  HEADER_SMD_10P05_BARE  [SMD_HEADER_10P05_BARE]
X-WAVEGEN  AD9833BRMZ  [SOP50P490X110-10N]
X_DC_REF  ADR01  ADR03AKSZ-REEL7  [SOT65P210X110-5N]
X_WAVECOND  AD8676BRMZ  [SOP65P490X110-8N]
Y-WAVEGEN  AD9833BRMZ  [SOP50P490X110-10N]
Y_DC_REF  ADR01  ADR03AKSZ-REEL7  [SOT65P210X110-5N]
Y_WAVECOND  AD8676BRMZ  [SOP65P490X110-8N]

### Nets
+3V3: 25_MHZ.4(VCC) C29.1 C30.1 C33.1 C34.1 C48.1 X-WAVEGEN.2(VDD) Y-WAVEGEN.2(VDD) ; also sheet 1,2,3,4,6
+12V: C27.1 C49.1 C51.1 C52.1 R47.3(E) R53.3(E) X_DC_REF.3(VIN) X_WAVECOND.8(V+) Y_DC_REF.3(VIN) Y_WAVECOND.8(V+) ; also sheet 2,3,4,6
-12V: C28.2 C50.2 R53.1(A) X_WAVECOND.4(V-) Y_WAVECOND.4(V-) ; also sheet 2,4,6
AGND: 25_MHZ.2(GND) C27.2 C28.1 C30.2 C31.2 C32.2 C33.2 C48.2 C49.2 C50.1 C51.2 C52.2 R47.1(A) R49.1 R56.1 R61.1 R65.1 U$1.5 U$1.6 X-WAVEGEN.4(DGND) X-WAVEGEN.9(AGND) X_DC_REF.2(GND) X_WAVECOND.5(+IN_B) Y-WAVEGEN.4(DGND) Y-WAVEGEN.9(AGND) Y_DC_REF.2(GND) Y_WAVECOND.5(+IN_B) ; also sheet 1,2,3,4,6
N$9: 25_MHZ.3(FO) X-WAVEGEN.5(MCLK) Y-WAVEGEN.5(MCLK)
N$23: C29.2 X-WAVEGEN.1(COMP)
N$24: C31.1 X-WAVEGEN.3(CAP/2.5V)
N$25: C57.2 R46.2 R51.1 X_WAVECOND.2(-IN_A)
N$27: R49.2 R50.2 X_WAVECOND.3(+IN_A)
N$28: C32.1 Y-WAVEGEN.3(CAP/2.5V)
N$29: C59.1 R57.2 R73.2 Y_WAVECOND.1(OUT_A)
N$30: R47.2(S) R50.1
N$31: R48.3(E) R72.1
N$35: C57.1 R51.2 R72.2 X_WAVECOND.1(OUT_A)
N$36: R63.1(A) R65.2
N$37: R48.1(A) R52.1
N$38: C34.2 Y-WAVEGEN.1(COMP)
N$40: C58.2 R48.2(S) X_WAVECOND.6(-IN_B)
N$41: C59.2 R54.2 R57.1 Y_WAVECOND.2(-IN_A)
N$42: R55.2 R56.2 Y_WAVECOND.3(+IN_A)
N$56: R53.2(S) R55.1
N$57: C60.2 R58.2(S) Y_WAVECOND.6(-IN_B)
N$58: R60.1(A) R61.2
N$60: R58.1(A) R59.1
N$69: R60.2(S) R62.2
N$75: R62.1 X_DC_REF.5(TRIM)
N$78: R63.2(S) R64.2
N$79: R64.1 Y_DC_REF.5(TRIM)
N$84: R58.3(E) R73.1
WAVEGEN_CLK_OE: 25_MHZ.1(OE) ; also sheet 1
WAVEGEN_SCK: X-WAVEGEN.7(SCLK) Y-WAVEGEN.7(SCLK) ; also sheet 1
WAVEGEN_SYNC: X-WAVEGEN.8(FSYNC) Y-WAVEGEN.8(FSYNC) ; also sheet 1
X_DC_IN: R60.3(E) U$1.3 X_DC_REF.4(VOUT) ; also sheet 6
X_OUT: U$1.4 ; also sheet 6
X_WAVE_IN: C58.1 R52.2 U$1.2 X_WAVECOND.7(OUT_B) ; also sheet 6
X_WAVE_RAW: R46.1 U$1.1 X-WAVEGEN.10(VOUT)
X_WAVEGEN_SDI: X-WAVEGEN.6(SDATA) ; also sheet 1
Y_DC_IN: R63.3(E) U$1.8 Y_DC_REF.4(VOUT) ; also sheet 6
Y_OUT: U$1.7 ; also sheet 6
Y_WAVE_IN: C60.1 R59.2 U$1.9 Y_WAVECOND.7(OUT_B) ; also sheet 6
Y_WAVE_RAW: R54.1 U$1.10 Y-WAVEGEN.10(VOUT)
Y_WAVEGEN_SDI: Y-WAVEGEN.6(SDATA) ; also sheet 1
Unconnected: X_DC_REF.1(TEMP) Y_DC_REF.1(TEMP)

### Buses
WAVEGEN_SCK,X_WAVEGEN_SDI,Y_WAVEGEN_SDI,WAVEGEN_SYNC
WAVEGEN_SCK,Y_WAVEGEN_SDI,WAVEGEN_SYNC

### Notes on the sheet
- VERTICAL TRIMPOTS: VISHAY SFERNICE TS63Y
  SMD PASSIVES: 0603 IMPERIAL
  SMD RESISTORS: 1% OR BETTER
- Copyright 2019 Marshall J. Colville
  mjc449@cornell.edu
  Distributed under the 2-Claus BSD License
  See LICENSE.txt in the project root directory for details

## Sheet 6 of 6: GALVO_SIGNAL_CONDITIONING
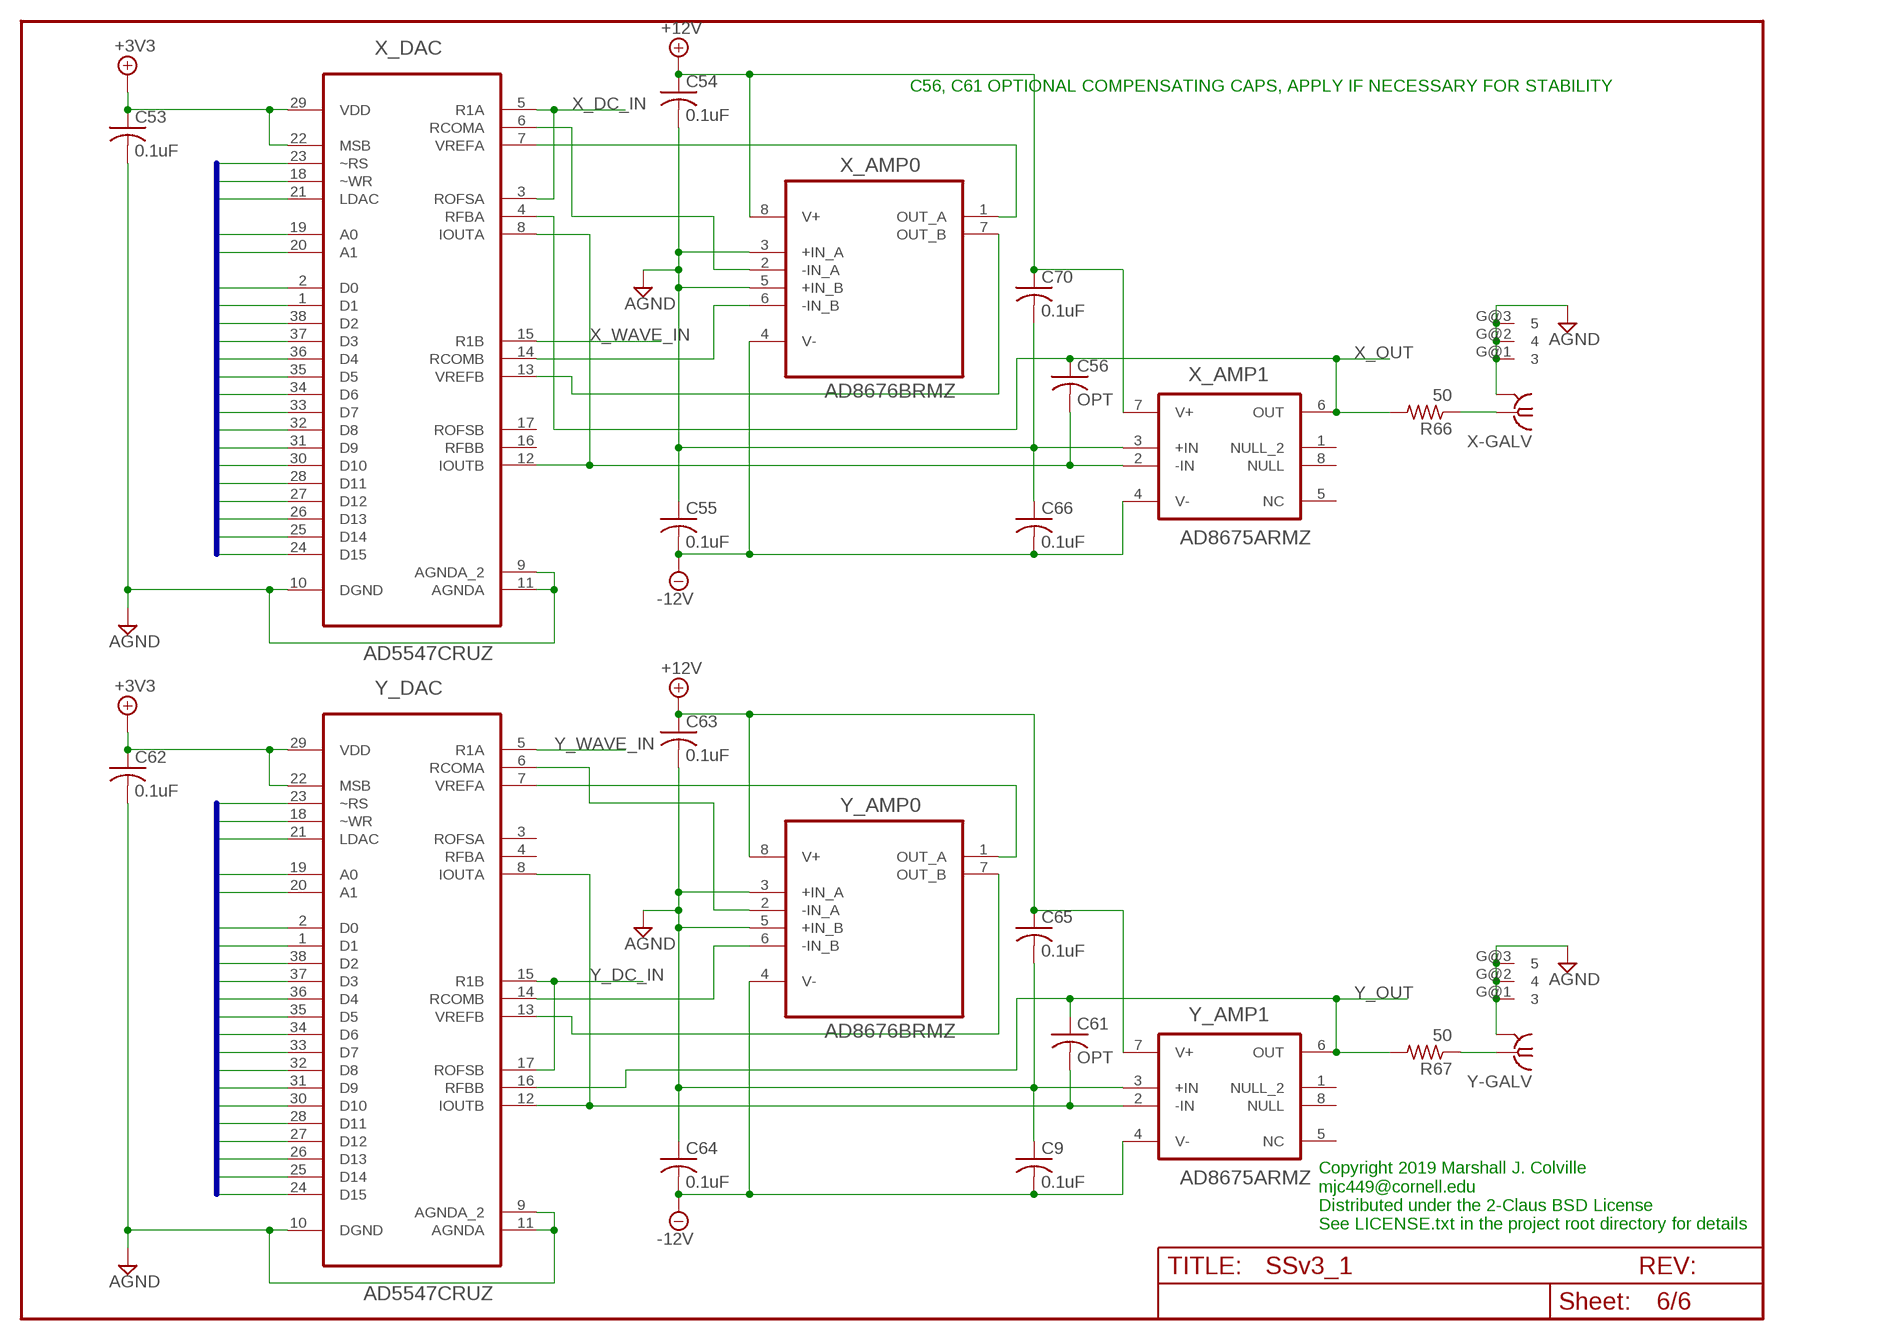
[diagram p5: schematic, sheet 6]

### Parts
C9  0.1uF  C-USC0603  [C0603]
C53  0.1uF  C-USC0603  [C0603]
C54  0.1uF  C-USC0603  [C0603]
C55  0.1uF  C-USC0603  [C0603]
C56  OPT  C-USC0603  [C0603]
C61  OPT  C-USC0603  [C0603]
C62  0.1uF  C-USC0603  [C0603]
C63  0.1uF  C-USC0603  [C0603]
C64  0.1uF  C-USC0603  [C0603]
C65  0.1uF  C-USC0603  [C0603]
C66  0.1uF  C-USC0603  [C0603]
C70  0.1uF  C-USC0603  [C0603]
R66  50  R-US_R0603  [R0603]
R67  50  R-US_R0603  [R0603]
X-GALV  SMA_SMT  [SIDE_MOUNTSMA]
X_AMP0  AD8676BRMZ  [SOP65P490X110-8N]
X_AMP1  AD8675ARMZ  [SOP65P490X110-8N]
X_DAC  AD5547CRUZ  [SOP50P640X120-38N]
Y-GALV  SMA_SMT  [SIDE_MOUNTSMA]
Y_AMP0  AD8676BRMZ  [SOP65P490X110-8N]
Y_AMP1  AD8675ARMZ  [SOP65P490X110-8N]
Y_DAC  AD5547CRUZ  [SOP50P640X120-38N]

### Nets
+3V3: C53.1 C62.1 X_DAC.22(MSB) X_DAC.29(VDD) Y_DAC.22(MSB) Y_DAC.29(VDD) ; also sheet 1,2,3,4,5
+12V: C54.1 C63.1 C65.1 C70.1 X_AMP0.8(V+) X_AMP1.7(V+) Y_AMP0.8(V+) Y_AMP1.7(V+) ; also sheet 2,3,4,5
-12V: C9.2 C55.2 C64.2 C66.2 X_AMP0.4(V-) X_AMP1.4(V-) Y_AMP0.4(V-) Y_AMP1.4(V-) ; also sheet 2,4,5
AGND: C9.1 C53.2 C54.2 C55.1 C62.2 C63.2 C64.1 C65.2 C66.1 C70.2 X-GALV.G@1 X-GALV.G@2 X-GALV.G@3 X-GALV.G@4 X_AMP0.3(+IN_A) X_AMP0.5(+IN_B) X_AMP1.3(+IN) X_DAC.9(AGNDA_2) X_DAC.10(DGND) X_DAC.11(AGNDA) Y-GALV.G@1 Y-GALV.G@2 Y-GALV.G@3 Y-GALV.G@4 Y_AMP0.3(+IN_A) Y_AMP0.5(+IN_B) Y_AMP1.3(+IN) Y_DAC.9(AGNDA_2) Y_DAC.10(DGND) Y_DAC.11(AGNDA) ; also sheet 1,2,3,4,5
GDAC_A0: X_DAC.19(A0) Y_DAC.19(A0) ; also sheet 1
GDAC_A1: X_DAC.20(A1) Y_DAC.20(A1) ; also sheet 1
GDAC_DB0: X_DAC.2(D0) Y_DAC.2(D0) ; also sheet 1,2
GDAC_DB1: X_DAC.1(D1) Y_DAC.1(D1) ; also sheet 1,2
GDAC_DB2: X_DAC.38(D2) Y_DAC.38(D2) ; also sheet 1
GDAC_DB3: X_DAC.37(D3) Y_DAC.37(D3) ; also sheet 1
GDAC_DB4: X_DAC.36(D4) Y_DAC.36(D4) ; also sheet 1
GDAC_DB5: X_DAC.35(D5) Y_DAC.35(D5) ; also sheet 1
GDAC_DB6: X_DAC.34(D6) Y_DAC.34(D6) ; also sheet 1
GDAC_DB7: X_DAC.33(D7) Y_DAC.33(D7) ; also sheet 1
GDAC_DB8: X_DAC.32(D8) Y_DAC.32(D8) ; also sheet 1
GDAC_DB9: X_DAC.31(D9) Y_DAC.31(D9) ; also sheet 1
GDAC_DB10: X_DAC.30(D10) Y_DAC.30(D10) ; also sheet 1
GDAC_DB11: X_DAC.28(D11) Y_DAC.28(D11) ; also sheet 1
GDAC_DB12: X_DAC.27(D12) Y_DAC.27(D12) ; also sheet 1
GDAC_DB13: X_DAC.26(D13) Y_DAC.26(D13) ; also sheet 1
GDAC_DB14: X_DAC.25(D14) Y_DAC.25(D14) ; also sheet 1
GDAC_DB15: X_DAC.24(D15) Y_DAC.24(D15) ; also sheet 1
GDAC_LOAD: X_DAC.21(LDAC) Y_DAC.21(LDAC) ; also sheet 1
GDAC_RS: X_DAC.23(~RS) Y_DAC.23(~RS) ; also sheet 1
N$33: Y_AMP0.2(-IN_A) Y_DAC.6(RCOMA)
N$49: X_AMP0.6(-IN_B) X_DAC.14(RCOMB)
N$54: Y_AMP0.1(OUT_A) Y_DAC.7(VREFA)
N$59: Y_AMP0.7(OUT_B) Y_DAC.13(VREFB)
N$62: R66.1 X-GALV.1
N$65: X_AMP0.2(-IN_A) X_DAC.6(RCOMA)
N$77: R67.1 Y-GALV.1
N$80: X_AMP0.7(OUT_B) X_DAC.13(VREFB)
N$81: C61.2 Y_AMP1.2(-IN) Y_DAC.8(IOUTA) Y_DAC.12(IOUTB)
N$82: Y_AMP0.6(-IN_B) Y_DAC.14(RCOMB)
N$83: X_AMP0.1(OUT_A) X_DAC.7(VREFA)
N$85: C56.2 X_AMP1.2(-IN) X_DAC.8(IOUTA) X_DAC.12(IOUTB)
X_DC_IN: X_DAC.3(ROFSA) X_DAC.5(R1A) ; also sheet 5
X_OUT: C56.1 R66.2 X_AMP1.6(OUT) X_DAC.4(RFBA) ; also sheet 5
X_WAVE_IN: X_DAC.15(R1B) ; also sheet 5
X_WR: X_DAC.18(~WR) ; also sheet 1
Y_DC_IN: Y_DAC.15(R1B) Y_DAC.17(ROFSB) ; also sheet 5
Y_OUT: C61.1 R67.2 Y_AMP1.6(OUT) Y_DAC.16(RFBB) ; also sheet 5
Y_WAVE_IN: Y_DAC.5(R1A) ; also sheet 5
Y_WR: Y_DAC.18(~WR) ; also sheet 1
Unconnected: X_AMP1.1(NULL_2) X_AMP1.5(NC) X_AMP1.8(NULL) X_DAC.16(RFBB) X_DAC.17(ROFSB) Y_AMP1.1(NULL_2) Y_AMP1.5(NC) Y_AMP1.8(NULL) Y_DAC.3(ROFSA) Y_DAC.4(RFBA)

### Buses
GDAC_RS,X_WR,Y_WR,GDAC_LOAD,GDAC_A0,GDAC_A1,GDAC_DB[0..15]

### Notes on the sheet
- C56, C61 OPTIONAL COMPENSATING CAPS, APPLY IF NECESSARY FOR STABILITY
- Copyright 2019 Marshall J. Colville
  mjc449@cornell.edu
  Distributed under the 2-Claus BSD License
  See LICENSE.txt in the project root directory for details

## Library data of the parts
3V3_REG = ECE5030:AP1117E33G_REG: 3.3 volt 1 amp regulator SOT223 case
25_MHZ = crystal:ASF*: CRYSTAL CLOCK OSCILLATORS 5.0 Vdc or 3.3 Vdc - LOW PROFILE ULTRA MINIATURE CERAMIC SURFACE MOUNT Source: http://www.abracon.com/Oscillators/asf1-L-L1.pdf; MF: Abracon Corporation; MPN: ASFL1-125.000MHZ-EC-T; OC_FARNELL: 1838931; OC_NEWARK: 19M1882
+3.3V +5V +12V -12V = ECE5030:TESTPOINT
+24V MAN_RST X2 = ECE5030:2PINHEADER: 2 pin 0.100" Header for 2 pin header pigtails I get from Allelectronics.
ADAC0 ADAC1 = mjc_ICs:AD5583YRVZ; MANUFACTURER_PART_NUMBER: AD5583YRVZ; VENDOR: Vendor
ADAC_REF AUX_REF_A AUX_REF_B X_DC_REF Y_DC_REF = Analog Devices_By_element14_Batch_1:ADR03AKSZ-REEL7: Ultracompact, Precision 10.0 V/5.0 V/2.5 V/3.0 V Voltage References; MPN: ADR03AKSZ-REEL7; OC_FARNELL: 1838919; OC_NEWARK: 59K2675; PACKAGE: SC70-5; SUPPLIER: Analog Devices
AOTF_DAC_CON = con-harting-ml:ML26: HARTING; OC_FARNELL: unknown; OC_NEWARK: unknown
AUX_A AUX_B X-GALV Y-GALV = ScanController_v6:SMA_SMT: SMA 50 Ohm End Launch Jack Receptacle - Round Contact
AUX_AMP_A AUX_AMP_B = Analog Devices_By_element14_Batch_1:OP2177ARMZ-R7: Operational Amplifiers; MPN: OP2177ARMZ-R7; OC_FARNELL: -; OC_NEWARK: 71P5435; PACKAGE: MSOP-8; SUPPLIER: Analog Devices
AUX_DACS = mjc_ICs:AD5440YRUZ
C1-C7 C9 C10 C15-C46 C48-C70 = MJC_PASS:C-US: CAPACITOR, American symbol
C8 = rcl:C-US: CAPACITOR, American symbol; SPICEPREFIX: C
C11-C14 C47 C71-C75 = rcl:CPOL-US: POLARIZED CAPACITOR, American symbol; SPICEPREFIX: C
D1 = SparkFun-DiscreteSemi:DIODE-ZENER: Zener Diode Production Part - 8199 3.4V Zener Voltage; PROD_ID: DIO-12440; VALUE: 16V
GRN-RUN = SSv3_1:LED_1206_GREEN: LEDs Standard schematic elements and footprints for 5mm, 3mm, 1206, and 0603 sized LEDs. 5mm - Spark Fun Electronics SKU : COM-00529 (and others)
JP1 JP2 = jumper:JP2E: JUMPER
POWER = ECE5030:4PINPIGTAIL: .100" (2.54mm) Center Header - 4 Pin
PWR_SHT_SCN_EXP SV1 = con-lstb:MA04-2: PIN HEADER; OC_FARNELL: unknown; OC_NEWARK: unknown
Q1 = MJC_MISC:CRYSTAL: CRYSTAL; OC_FARNELL: unknown; OC_NEWARK: unknown
Q2 = SparkFun-DiscreteSemi:MOSFET-NCHANNEL: Common NMOSFET Parts MFG P/N Store ID Prod ID FDD8780 TRANS-09984 SI7820DN TRANS-11055 FDS6630A IC-08089 2N7002PW TRANS-11151 FQP30N06L COM-10213 TRANS-10060 BSS123LT1G TRANS-08345 BSS138 TRANS-00830 BS170 2N7000; PROD_ID: TRANS-00830
R1-R21 R23-R32 R34 R35 R37-R46 R49-R52 R54-R57 R59 R61 R62 R64-R67 R72 R73 R79-R81 = MJC_PASS:R-US_: RESISTOR, American symbol
R47 R48 R53 R58 R60 R63 R74-R76 = rcl:R-TRIMM: Trimm resistor; SPICEMODEL: X; SPICEPREFIXL: POT
RED-PRG = SSv3_1:LED_1206_RED: LEDs Standard schematic elements and footprints for 5mm, 3mm, 1206, and 0603 sized LEDs. 5mm - Spark Fun Electronics SKU : COM-00529 (and others)
U$1 = MJC_CONN:HEADER_SMD_10P05_BARE
U$2 = MJC_MISC:4PDT: 4 pole, double thrown slide switch (4PDT). Common pins = 2, 5, 8 & 11 Slide toward "ALCO": 2->1, 5->4, 8->7, 11->10 Slide away from "ALCO": 2->3, 5->6, 8->9, 11->12
U$3 = mjc_ICs:PIC24FJ256GB210-I/PT
X1 = ScanController_v6:PN61729-S: BERG USB connector; OC_FARNELL: unknown; OC_NEWARK: unknown
X3 = con-tycoelectronics:RJ45: CORCOM Modular RJ Jacks No Shield Source: www.tycoelectronics.com .. ENG_DS_1654001_1099_RJ_L_0507.pdf; MPN: RJ45-6L-B; OC_FARNELL: unknown; OC_NEWARK: 16R6090
X4 = con-molex:C-GRID-06: CONNECTOR wire to board 2.54 mm (0.100") pitch header; MF: MOLEX; OC_FARNELL: unknown; OC_NEWARK: unknown
X-WAVEGEN Y-WAVEGEN = Analog Devices_By_element14_Batch_1:AD9833BRMZ: Low Power 12.65 mW, 2.3 V to 5.5 V,Low Power 12.65 mW, 2.3 V to 5.5 V,Low Power 12.65 mW, 2.3 V to 5.5 V,Programmable Waveform Generator; MPN: AD9833BRMZ; OC_FARNELL: 1581966; OC_NEWARK: 19M1014; PACKAGE: MSOP-10; SUPPLIER: Analog Devices
X_AMP0 X_WAVECOND Y_AMP0 Y_WAVECOND = Analog Devices_By_element14_Batch_1:AD8676BRMZ: Dual Rail-to-Rail Output Op Amp; MPN: AD8676BRMZ; OC_FARNELL: -; OC_NEWARK: 45P6472; PACKAGE: MSOP-8; SUPPLIER: ANALOG DEVICES
X_AMP1 Y_AMP1 = mjc_ICs:AD8675ARMZ: Rail-to-Rail Output Operational Amplifiers; MPN: AD8675ARMZ; OC_FARNELL: 2074881; OC_NEWARK: 34P3255; PACKAGE: MSOP-8; SUPPLIER: Analog Devices
X_DAC Y_DAC = mjc_ICs:AD5547CRUZ: DAC; MPN: AD5547CRUZ; OC_FARNELL: -; OC_NEWARK: 51R0726; PACKAGE: SOP-38; SUPPLIER: Analog Devices